# Altium schematic sheet HMI.SchDoc
size A3; SheetNumber: 19; SheetTotal: 32
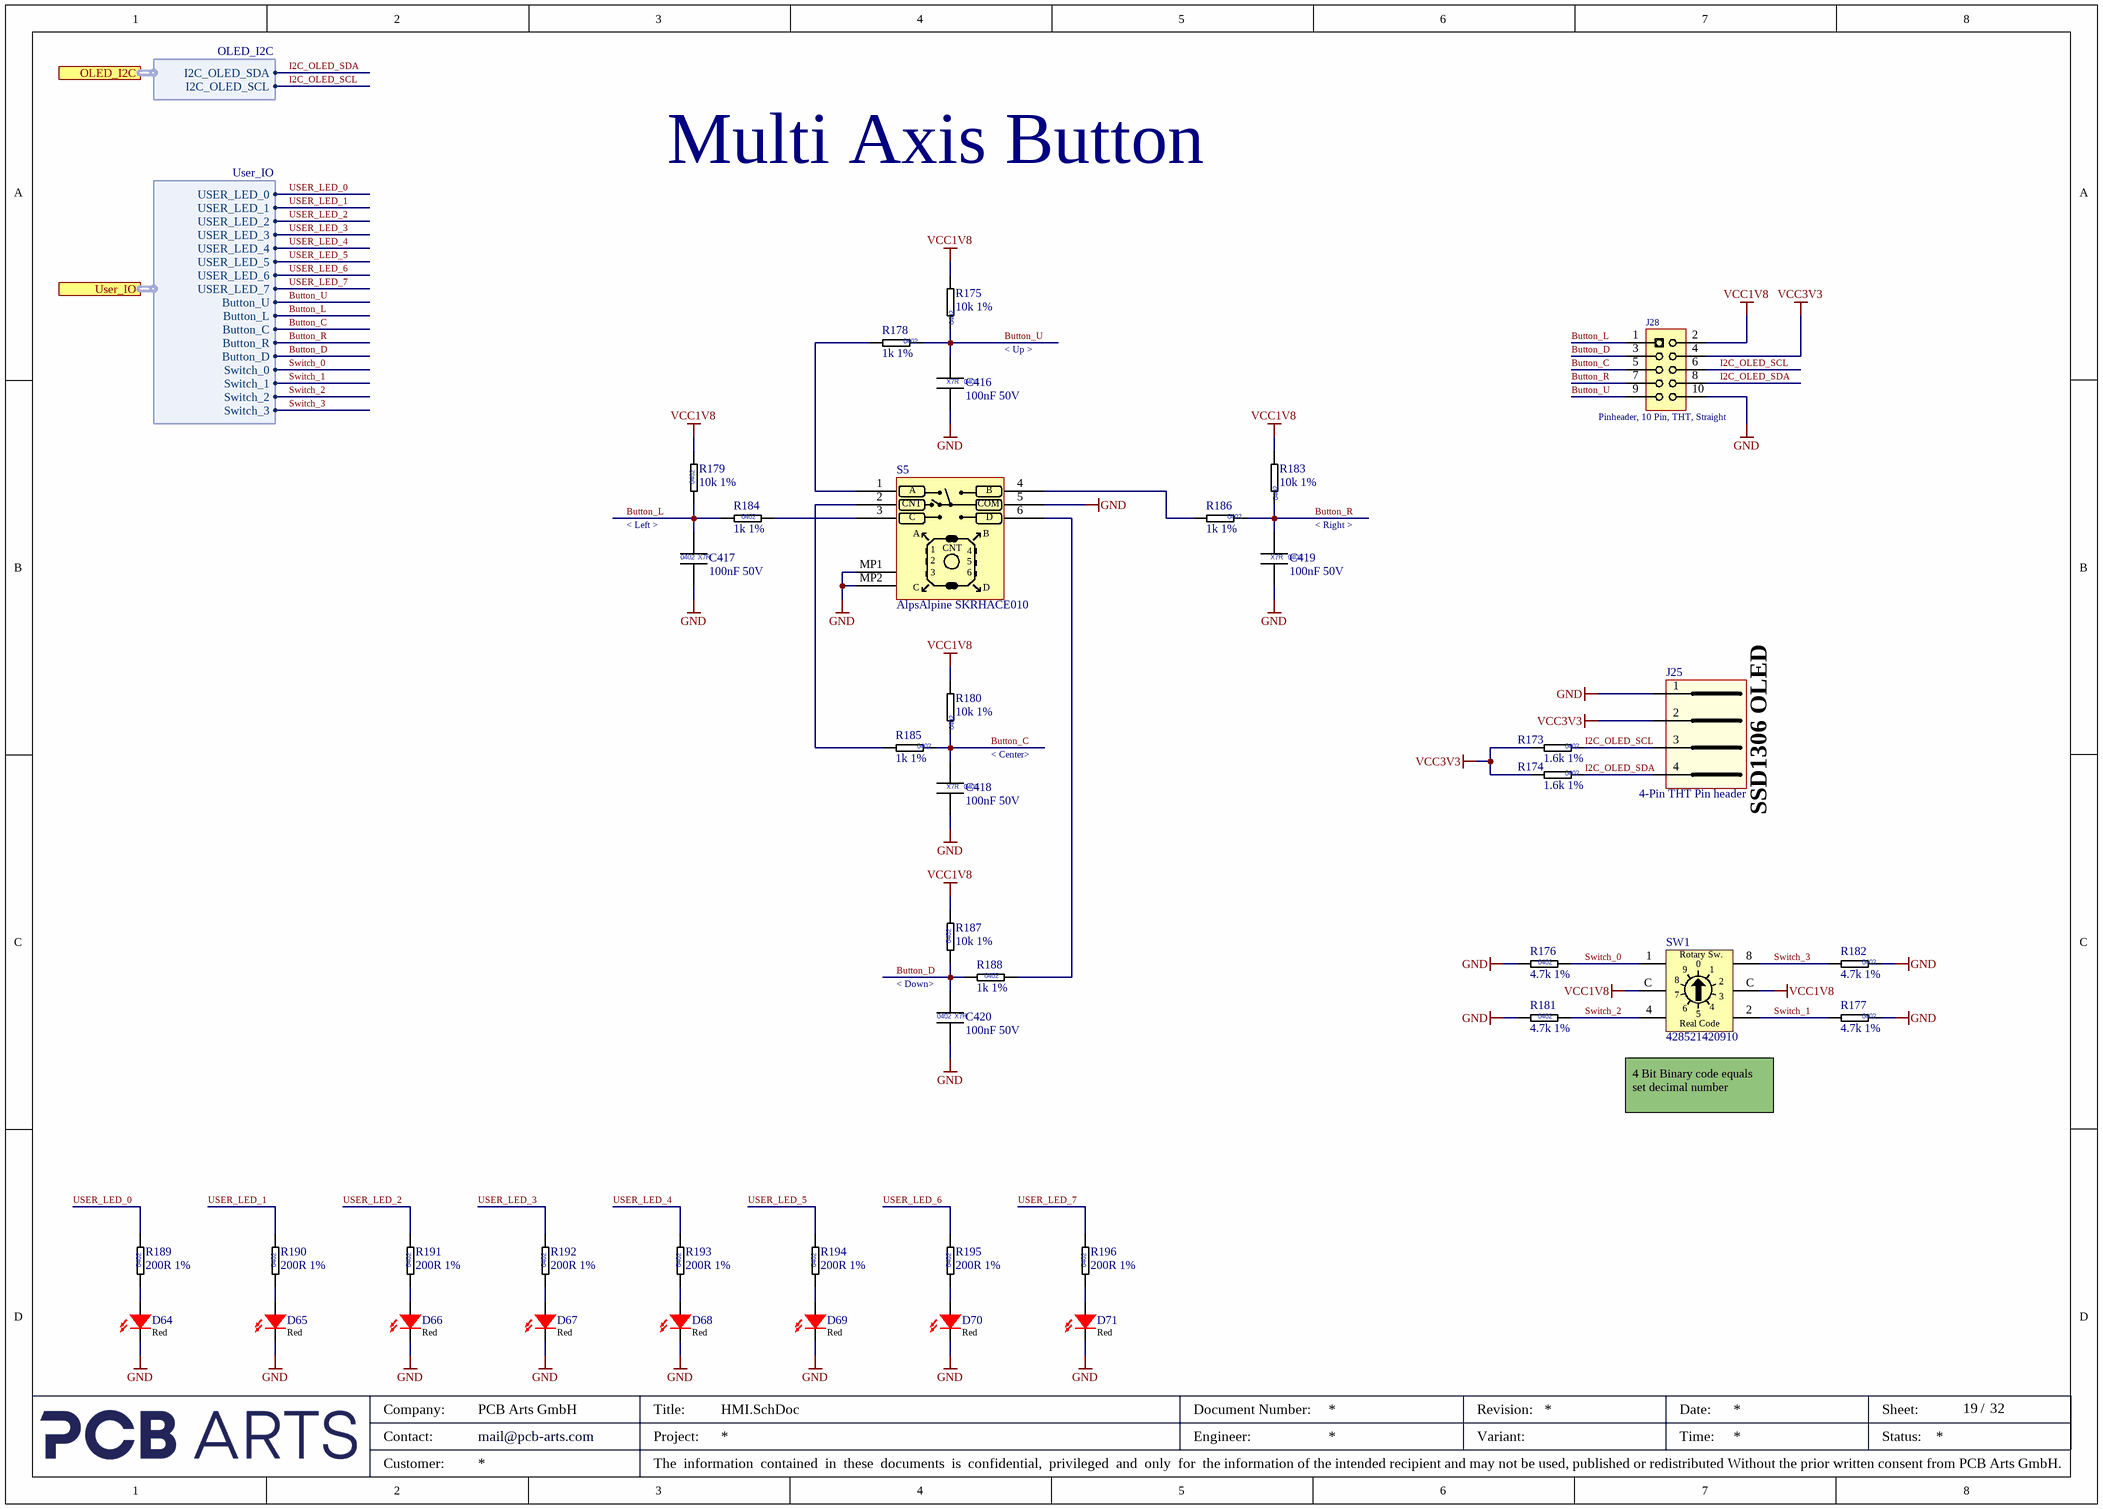
[diagram p0: HMI.SchDoc]

## Parts
C416  100nF 50V  [CAP_0402_L]
C417  100nF 50V  [CAP_0402_L]
C418  100nF 50V  [CAP_0402_L]
C419  100nF 50V  [CAP_0402_L]
C420  100nF 50V  [CAP_0402_L]
D64  Color: Red  [LED-0603 Sideview]  (hidden comment: LTST-S270KRKT)
D65  Color: Red  [LED-0603 Sideview]  (hidden comment: LTST-S270KRKT)
D66  Color: Red  [LED-0603 Sideview]  (hidden comment: LTST-S270KRKT)
D67  Color: Red  [LED-0603 Sideview]  (hidden comment: LTST-S270KRKT)
D68  Color: Red  [LED-0603 Sideview]  (hidden comment: LTST-S270KRKT)
D69  Color: Red  [LED-0603 Sideview]  (hidden comment: LTST-S270KRKT)
D70  Color: Red  [LED-0603 Sideview]  (hidden comment: LTST-S270KRKT)
D71  Color: Red  [LED-0603 Sideview]  (hidden comment: LTST-S270KRKT)
J25  4-Pin THT Pin header  [61300411121]
J28  Pinheader, 10 Pin, THT, Straight  [62701021621]
R173  1.6k 1%  [RES_0402_L]
R174  1.6k 1%  [RES_0402_L]
R175  10k 1%  [RES_0402_L]
R176  4.7k 1%  [RES_0402_L]
R177  4.7k 1%  [RES_0402_L]
R178  1k 1%  [RES_0402_L]
R179  10k 1%  [RES_0402_L]
R180  10k 1%  [RES_0402_L]
R181  4.7k 1%  [RES_0402_L]
R182  4.7k 1%  [RES_0402_L]
R183  10k 1%  [RES_0402_L]
R184  1k 1%  [RES_0402_L]
R185  1k 1%  [RES_0402_L]
R186  1k 1%  [RES_0402_L]
R187  10k 1%  [RES_0402_L]
R188  1k 1%  [RES_0402_L]
R189  200R 1%  [RES_0402_L]
R190  200R 1%  [RES_0402_L]
R191  200R 1%  [RES_0402_L]
R192  200R 1%  [RES_0402_L]
R193  200R 1%  [RES_0402_L]
R194  200R 1%  [RES_0402_L]
R195  200R 1%  [RES_0402_L]
R196  200R 1%  [RES_0402_L]
S5  AlpsAlpine SKRHACE010  [AlpsAlpine_SKRHACE010]
SW1  428521420910  [WÜRTH 428521420910]

## Ports
OLED_I2C (harness OLED_I2C, see Top-Level-Sheet[6C], I2C Multiplexer[7B]), User_IO (harness User_IO, see Top-Level-Sheet[6C], Bank 0_Bank 14[8B])

## Harnesses
OLED_I2C: I2C_OLED_SDA, I2C_OLED_SCL
User_IO: USER_LED_0, USER_LED_1, USER_LED_2, USER_LED_3, USER_LED_4, USER_LED_5, USER_LED_6, USER_LED_7, Switch_0, Switch_1, Switch_2, Switch_3, Button_L, Button_U, Button_C, Button_R, Button_D

## Nets
GND: C416.2 C417.2 C418.2 C419.2 C420.2 D64.1 D65.1 D66.1 D67.1 D68.1 D69.1 D70.1 D71.1 J25.1 J28.10 R176.1 R177.1 R181.1 R182.1 S5.5 S5.MP1 S5.MP2
VCC1V8: J28.2 R175.2 R179.2 R180.2 R183.2 R187.2 SW1.C
VCC3V3: J25.2 J28.4 R173.2 R174.2
Button_C: C418.1 J28.5 R180.1 R185.1 ; port User_IO.Button_C
Button_D: C420.1 J28.3 R187.1 R188.1 ; port User_IO.Button_D
Button_L: C417.1 J28.1 R179.1 R184.1 ; port User_IO.Button_L
Button_R: C419.1 J28.7 R183.1 R186.1 ; port User_IO.Button_R
Button_U: C416.1 J28.9 R175.1 R178.1 ; port User_IO.Button_U
I2C_OLED_SCL: J25.3 J28.6 R173.1 ; port OLED_I2C.I2C_OLED_SCL
I2C_OLED_SDA: J25.4 J28.8 R174.1 ; port OLED_I2C.I2C_OLED_SDA
Switch_0: R176.2 SW1.1 ; port User_IO.Switch_0
Switch_1: R177.2 SW1.2 ; port User_IO.Switch_1
Switch_2: R181.2 SW1.4 ; port User_IO.Switch_2
Switch_3: R182.2 SW1.8 ; port User_IO.Switch_3
USER_LED_0: R189.2 ; port User_IO.USER_LED_0
USER_LED_1: R190.2 ; port User_IO.USER_LED_1
USER_LED_2: R191.2 ; port User_IO.USER_LED_2
USER_LED_3: R192.2 ; port User_IO.USER_LED_3
USER_LED_4: R193.2 ; port User_IO.USER_LED_4
USER_LED_5: R194.2 ; port User_IO.USER_LED_5
USER_LED_6: R195.2 ; port User_IO.USER_LED_6
USER_LED_7: R196.2 ; port User_IO.USER_LED_7
NetD64_2: D64.2 R189.1
NetD65_2: D65.2 R190.1
NetD66_2: D66.2 R191.1
NetD67_2: D67.2 R192.1
NetD68_2: D68.2 R193.1
NetD69_2: D69.2 R194.1
NetD70_2: D70.2 R195.1
NetD71_2: D71.2 R196.1
NetR178_2: R178.2 S5.1
NetR184_2: R184.2 S5.3
NetR185_2: R185.2 S5.2
NetR186_2: R186.2 S5.4
NetR188_2: R188.2 S5.6

## Notes on the sheet
- Multi Axis Button
- < Up >
- < Left >
- < Right >
- < Center>
- SSD1306 OLED
- < Down>
- (near SW1) 4 Bit Binary code equals set decimal number
- Company:
- Contact:
- Customer:
- mail@pcb-arts.com
- PCB Arts GmbH
- Title:
- Project:
- The  information  contained  in  these  documents  is  confidential,  privileged  and  only  for  the information of the intended recipient and may not be used, published or redistributed Without the prior written consent from PCB Arts GmbH.
- Engineer:
- Document Number:
- Revision:
- Variant:
- Date:
- Time:
- Sheet:
- Status:
- /
- (in symbol 428521420910_Rotary Switch WS-ROSV 10Pos Real Code) Rotary Sw.; 0; 9; 7; 3; 6; 5; Real Code
- (in symbol AlpsAlpine_ SKRHACE010_Multi-Directional-Switches_4-directions_center-push) A; B; CNT; COM; C; D
- (in symbol CAP_0402_100nF_50V) 0402; X7R
- (in symbol RES_0402_1.6k_1%) 0402
- (in symbol RES_0402_1k_1%) 0402
- (in symbol RES_0402_4.7k_1%) 0402
- (in symbol RES_0402_10k_1%) 0402
- (in symbol RES_0402_200R 1%) 0402

## Library data of the parts
C416-C420 = CAP_0402_100nF_50V: Multilayer Ceramic Capacitors MLCC - SMD/SMT 0402 50VDC; Manufacturer 1: Murata Electronics; Manufacturer 1 Prt. Nr.: GCM155L8EH104KE07D; Manufacturer 2 Prt. Nr.: UMK105B7104KV-FR; Manufacturer 2: TDK
D64-D71 = LED 0603 Red Sideview: RED  0603 Light Emitting Diode; Manufacturer 1: lite-On; Manufacturer 1 Prt. Nr.: LTST-S270KRKT
J25 = 61300411121_WR-PHD 2.54mm 4Pin THT Header: WR-PHD 2.54mm 4Pin THT Header; Manufacturer 1: Würth Elektronik; Manufacturer 1 Prt. Nr.: 61300411121
J28 = 62701021621_Box Pin header THT 1.27mm 10Pol Straight: Box Pin header THT 1.27mm 10Pol Straight; Manufacturer 1: Würth Elektronik; Manufacturer 1 Prt. Nr.: 62701021621
R173 R174 = RES_0402_1.6k_1%: Thick Film Resistors - SMD 1.6kOhm 1%; Manufacturer 1: Vishay / Dale; Manufacturer 1 Prt. Nr.: CRCW04021K60FKEDC; Manufacturer 2 Prt. Nr.: RC0402FR-7W1K6L; Manufacturer 2: Yageo
R175 R179 R180 R183 R187 = RES_0402_10k_1%: Thick Film Resistors - SMD 10kOhm 1%; Manufacturer 1: Vishay / Dale; Manufacturer 1 Prt. Nr.: CRCW040210K0FKEDC; Manufacturer 2 Prt. Nr.: RC0402FR-7W10KL; Manufacturer 2: Yageo
R176 R177 R181 R182 = RES_0402_4.7k_1%: Thick Film Resistors - SMD 4.7kOhm 1%; Manufacturer 1: Vishay / Dale; Manufacturer 1 Prt. Nr.: CRCW04024K70FKEDC; Manufacturer 2 Prt. Nr.: RC0402FR-134K7L; Manufacturer 2: Yageo
R178 R184-R186 R188 = RES_0402_1k_1%: Thick Film Resistors - SMD 1kOhm 1%; Manufacturer 1: Vishay / Dale; Manufacturer 1 Prt. Nr.: CRCW04021K00FKEDC; Manufacturer 2 Prt. Nr.: RC0402FR-7W1KL; Manufacturer 2: Yageo
R189-R196 = RES_0402_200R 1%: Thick Film Resistors - SMD 200Ohm 1%; Manufacturer 1: Vishay / Dale; Manufacturer 1 Prt. Nr.: CRCW0402200RFKEDC; Manufacturer 2 Prt. Nr.: AF0402FR-07200RL; Manufacturer 2: Yageo
S5 = AlpsAlpine_ SKRHACE010_Multi-Directional-Switches_4-directions_center-push: Multi-Directional Switches, 4-directions, center-push; Manufacturer 1 Prt. Nr.: SKRHACE010; Manufacturer 1: Alps Alpine
SW1 = 428521420910_Rotary Switch WS-ROSV 10Pos Real Code: Rotary Switches WS-ROSV IP67 10Pos 2.54mm Lt Grey; Manufacturer 1: Würth Elektronik; Manufacturer 1 Prt. Nr.: 428521420910